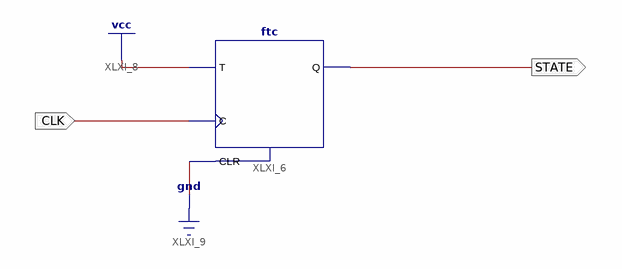
[diagram p0: schematic sheet 1]
// Xilinx ISE schematic State.sch (spartan6) as structural Verilog: 1 symbols, 2 ports
module State (
  input  CLK,
  output STATE
);

  ftc XLXI_6 (.C(CLK), .CLR(1'b0), .T(1'b1), .Q(STATE));
endmodule
